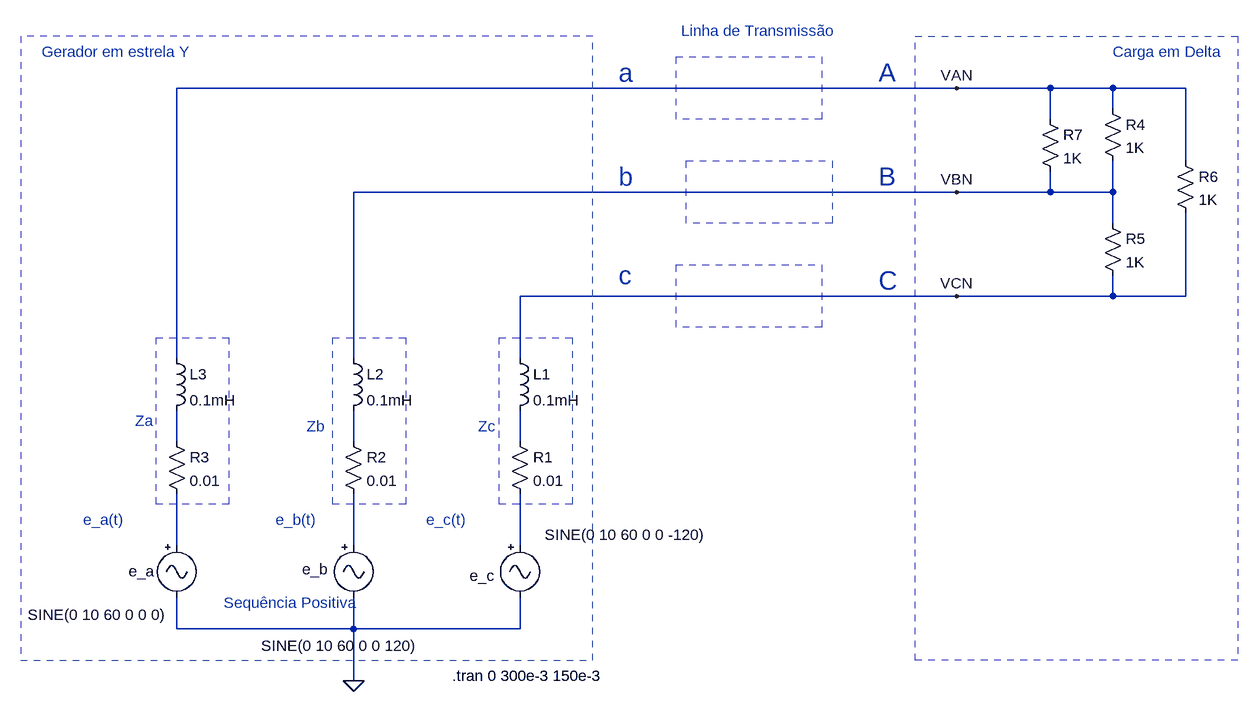
[diagram p0: schematic GeradorYCargaDeltaLinha_3_2_2.asc]
GeradorYCargaDeltaLinha_3_2_2.asc, the LTspice schematic file:
Version 4
SHEET 1 1048 680
WIRE 320 -688 -880 -688
WIRE 464 -688 320 -688
WIRE 560 -688 464 -688
WIRE 672 -688 560 -688
WIRE 560 -656 560 -688
WIRE 464 -640 464 -688
WIRE 672 -576 672 -688
WIRE 320 -528 -608 -528
WIRE 464 -528 464 -560
WIRE 464 -528 320 -528
WIRE 560 -528 560 -576
WIRE 560 -528 464 -528
WIRE 560 -480 560 -528
WIRE 320 -368 -352 -368
WIRE 560 -368 560 -400
WIRE 560 -368 320 -368
WIRE 672 -368 672 -496
WIRE 672 -368 560 -368
WIRE -880 -272 -880 -688
WIRE -608 -272 -608 -528
WIRE -352 -272 -352 -368
WIRE -880 -144 -880 -192
WIRE -608 -144 -608 -192
WIRE -352 -144 -352 -192
WIRE -880 16 -880 -64
WIRE -608 16 -608 -64
WIRE -352 16 -352 -64
WIRE -880 144 -880 96
WIRE -608 144 -608 96
WIRE -608 144 -880 144
WIRE -352 144 -352 96
WIRE -352 144 -608 144
WIRE -608 224 -608 144
FLAG -608 224 0
FLAG 320 -688 VAN
FLAG 320 -528 VBN
FLAG 320 -368 VCN
SYMBOL Misc\\signal -880 0 R0
WINDOW 0 -74 55 Left 2
WINDOW 3 -229 122 Left 2
WINDOW 123 0 0 Left 0
WINDOW 39 0 0 Left 0
SYMATTR InstName e_a
SYMATTR Value SINE(0 10 60 0 0 0)
SYMBOL Misc\\signal -608 0 R0
WINDOW 0 -79 52 Left 2
WINDOW 3 -142 170 Left 2
WINDOW 123 0 0 Left 0
WINDOW 39 0 0 Left 0
SYMATTR InstName e_b
SYMATTR Value SINE(0 10 60 0 0 120)
SYMBOL Misc\\signal -352 0 R0
WINDOW 0 -77 62 Left 2
WINDOW 3 38 -1 Left 2
WINDOW 123 0 0 Left 0
WINDOW 39 0 0 Left 0
SYMATTR InstName e_c
SYMATTR Value SINE(0 10 60 0 0 -120)
SYMBOL res -368 -160 R0
SYMATTR InstName R1
SYMATTR Value 0.01
SYMBOL res -624 -160 R0
SYMATTR InstName R2
SYMATTR Value 0.01
SYMBOL res -896 -160 R0
SYMATTR InstName R3
SYMATTR Value 0.01
SYMBOL ind -368 -288 R0
SYMATTR InstName L1
SYMATTR Value 0.1mH
SYMBOL ind -624 -288 R0
SYMATTR InstName L2
SYMATTR Value 0.1mH
SYMBOL ind -896 -288 R0
SYMATTR InstName L3
SYMATTR Value 0.1mH
SYMBOL res 544 -672 R0
SYMATTR InstName R4
SYMATTR Value 1K
SYMATTR SpiceLine pwr=0.25
SYMBOL res 544 -496 R0
SYMATTR InstName R5
SYMATTR Value 1K
SYMATTR SpiceLine pwr=0.25
SYMBOL res 656 -592 R0
SYMATTR InstName R6
SYMATTR Value 1K
SYMATTR SpiceLine pwr=0.25
SYMBOL res 448 -656 R0
SYMATTR InstName R7
SYMATTR Value 1K
SYMATTR SpiceLine pwr=0.25
TEXT -456 216 Left 2 !.tran 0 300e-3 150e-3
TEXT -1024 -24 Left 2 ;e_a(t)
TEXT -728 -24 Left 2 ;e_b(t)
TEXT -496 -24 Left 2 ;e_c(t)
TEXT -808 104 Left 2 ;Sequência Positiva
TEXT -944 -176 Left 2 ;Za
TEXT -680 -168 Left 2 ;Zb
TEXT -416 -168 Left 2 ;Zc
TEXT -1088 -744 Left 2 ;Gerador em estrela Y
TEXT -104 -776 Left 2 ;Linha de Transmissão
TEXT -200 -712 Left 4 ;a
TEXT -200 -552 Left 4 ;b
TEXT -200 -400 Left 4 ;c
TEXT 200 -712 Left 4 ;A
TEXT 200 -552 Left 4 ;B
TEXT 200 -392 Left 4 ;C
TEXT 560 -744 Left 2 ;Carga em Delta
RECTANGLE Normal -800 -48 -912 -304 2
RECTANGLE Normal -528 -48 -640 -304 2
RECTANGLE Normal -272 -48 -384 -304 2
RECTANGLE Normal -1120 192 -240 -768 2
RECTANGLE Normal 112 -320 -112 -416 2
RECTANGLE Normal 128 -480 -96 -576 2
RECTANGLE Normal 112 -640 -112 -736 2
RECTANGLE Normal 752 192 256 -768 2

The netlist it stands for:
* GeradorYCargaDeltaLinha_3_2_2.asc
V§e_a N004 0 SINE(0 10 60 0 0 0)
V§e_b N005 0 SINE(0 10 60 0 0 120)
V§e_c N006 0 SINE(0 10 60 0 0 -120)
R1 N003 N006 0.01
R2 N002 N005 0.01
R3 N001 N004 0.01
L1 VCN N003 0.1mH
L2 VBN N002 0.1mH
L3 VAN N001 0.1mH
R4 VAN VBN 1K pwr=0.25
R5 VBN VCN 1K pwr=0.25
R6 VAN VCN 1K pwr=0.25
R7 VAN VBN 1K pwr=0.25
.tran 0 300e-3 150e-3
* e_a(t)
* e_b(t)
* e_c(t)
* Sequência Positiva
* Za
* Zb
* Zc
* Gerador em estrela Y
* Linha de Transmissão
* a
* b
* c
* A
* B
* C
* Carga em Delta
.backanno
.end